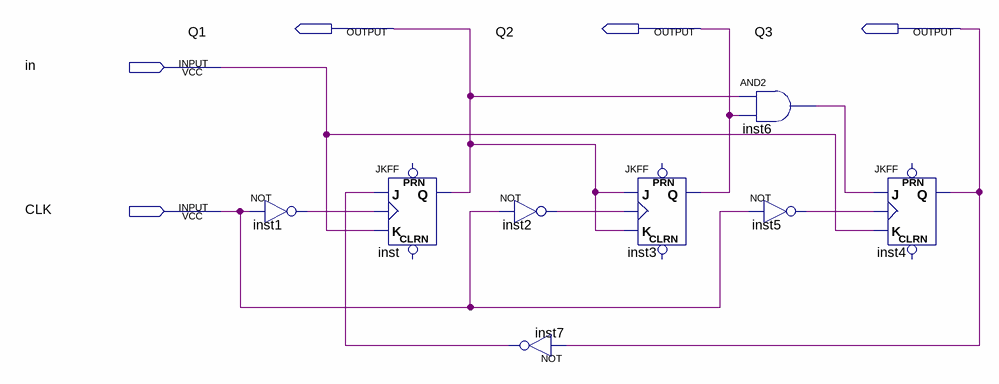
[diagram p0: schematic sheet]
// Quartus schematic ex2-3.bdf as structural Verilog: 8 symbols, 5 pins
module \ex2-3  (
  input  in,
  input  CLK,
  output Q1,
  output Q2,
  output Q3
);

  wire inst1_out, inst2_out, inst5_out, inst6_out, inst7_out;

  not inst1 (inst1_out, CLK);
  JKFF inst (.K(in), .J(inst7_out), .CLK(inst1_out), .Q(Q1));  // open: PRN, CLRN
  not inst2 (inst2_out, CLK);
  not inst7 (inst7_out, Q3);
  JKFF inst3 (.K(Q1), .J(Q1), .CLK(inst2_out), .Q(Q2));  // open: PRN, CLRN
  and inst6 (inst6_out, Q1, Q2);
  not inst5 (inst5_out, CLK);
  JKFF inst4 (.K(in), .J(inst6_out), .CLK(inst5_out), .Q(Q3));  // open: PRN, CLRN
endmodule
